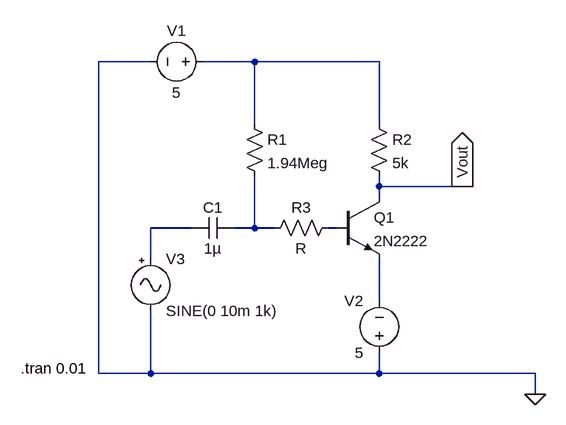
[diagram p0: schematic Test3.asc]
Test3.asc, the LTspice schematic file:
Version 4
SHEET 1 880 680
WIRE 128 96 48 96
WIRE 288 96 208 96
WIRE 480 96 288 96
WIRE 288 192 288 96
WIRE 480 192 480 96
WIRE 480 288 480 272
WIRE 608 288 480 288
WIRE 624 288 608 288
WIRE 480 304 480 288
WIRE 192 352 128 352
WIRE 288 352 288 272
WIRE 288 352 256 352
WIRE 320 352 288 352
WIRE 416 352 400 352
WIRE 128 400 128 352
WIRE 480 464 480 400
WIRE 48 576 48 96
WIRE 128 576 128 480
WIRE 128 576 48 576
WIRE 480 576 480 544
WIRE 480 576 128 576
WIRE 720 576 480 576
WIRE 720 608 720 576
FLAG 720 608 0
FLAG 608 288 Vout
IOPIN 608 288 Out
SYMBOL voltage 224 96 R90
WINDOW 0 -32 56 VBottom 2
WINDOW 3 32 56 VTop 2
SYMATTR InstName V1
SYMATTR Value 5
SYMBOL res 272 176 R0
SYMATTR InstName R1
SYMATTR Value 1.94Meg
SYMBOL res 464 176 R0
SYMATTR InstName R2
SYMATTR Value 5k
SYMBOL npn 416 304 R0
SYMATTR InstName Q1
SYMATTR Value 2N2222
SYMBOL voltage 480 560 R180
WINDOW 0 24 96 Left 2
WINDOW 3 24 16 Left 2
SYMATTR InstName V2
SYMATTR Value 5
SYMBOL cap 256 336 R90
WINDOW 0 0 32 VBottom 2
WINDOW 3 32 32 VTop 2
SYMATTR InstName C1
SYMATTR Value 1µ
SYMBOL Misc/signal 128 384 R0
SYMATTR InstName V3
SYMATTR Value SINE(0 10m 1k)
SYMBOL res 416 336 R90
WINDOW 0 0 56 VBottom 2
WINDOW 3 32 56 VTop 2
SYMATTR InstName R3
TEXT -72 568 Left 2 !.tran 0.01

The netlist it stands for:
* Test3.asc
V1 N001 0 5
R1 N001 N003 1.94Meg
R2 N001 Vout 5k
Q1 Vout N004 N005 0 2N2222
V2 0 N005 5
C1 N003 N002 1µ
V3 N002 0 SINE(0 10m 1k)
R3 N004 N003 R
.model NPN NPN
.model PNP PNP
.lib standard.bjt
.tran 0.01
.backanno
.end